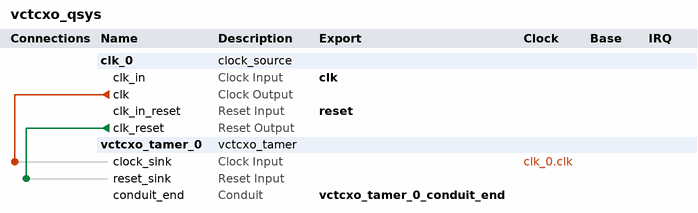
[diagram p0: system contents]
# Platform Designer (Qsys) system vctcxo_qsys, Cyclone V 5CEBA4F23C8
# Parameters at their usual value, and those the tool derives, are not listed.
package require -exact qsys 20.1
create_system vctcxo_qsys
set_project_property DEVICE_FAMILY {Cyclone V}
set_project_property DEVICE 5CEBA4F23C8

add_instance clk_0 clock_source 20.1
set_instance_parameter_value clk_0 clockFrequency 80000000

add_instance vctcxo_tamer_0 vctcxo_tamer 1.0

# connections
add_connection clk_0.clk vctcxo_tamer_0.clock_sink clock
add_connection clk_0.clk_reset vctcxo_tamer_0.reset_sink reset

# exported interfaces
add_interface clk clock sink
set_interface_property clk EXPORT_OF clk_0.clk_in
add_interface reset reset sink
set_interface_property reset EXPORT_OF clk_0.clk_in_reset
add_interface vctcxo_tamer_0_conduit_end conduit end
set_interface_property vctcxo_tamer_0_conduit_end EXPORT_OF vctcxo_tamer_0.conduit_end

set_interconnect_requirement {$system} qsys_mm.clockCrossingAdapter HANDSHAKE
set_interconnect_requirement {$system} qsys_mm.enableEccProtection FALSE
set_interconnect_requirement {$system} qsys_mm.insertDefaultSlave FALSE
set_interconnect_requirement {$system} qsys_mm.maxAdditionalLatency 1

save_system vctcxo_qsys.qsys
